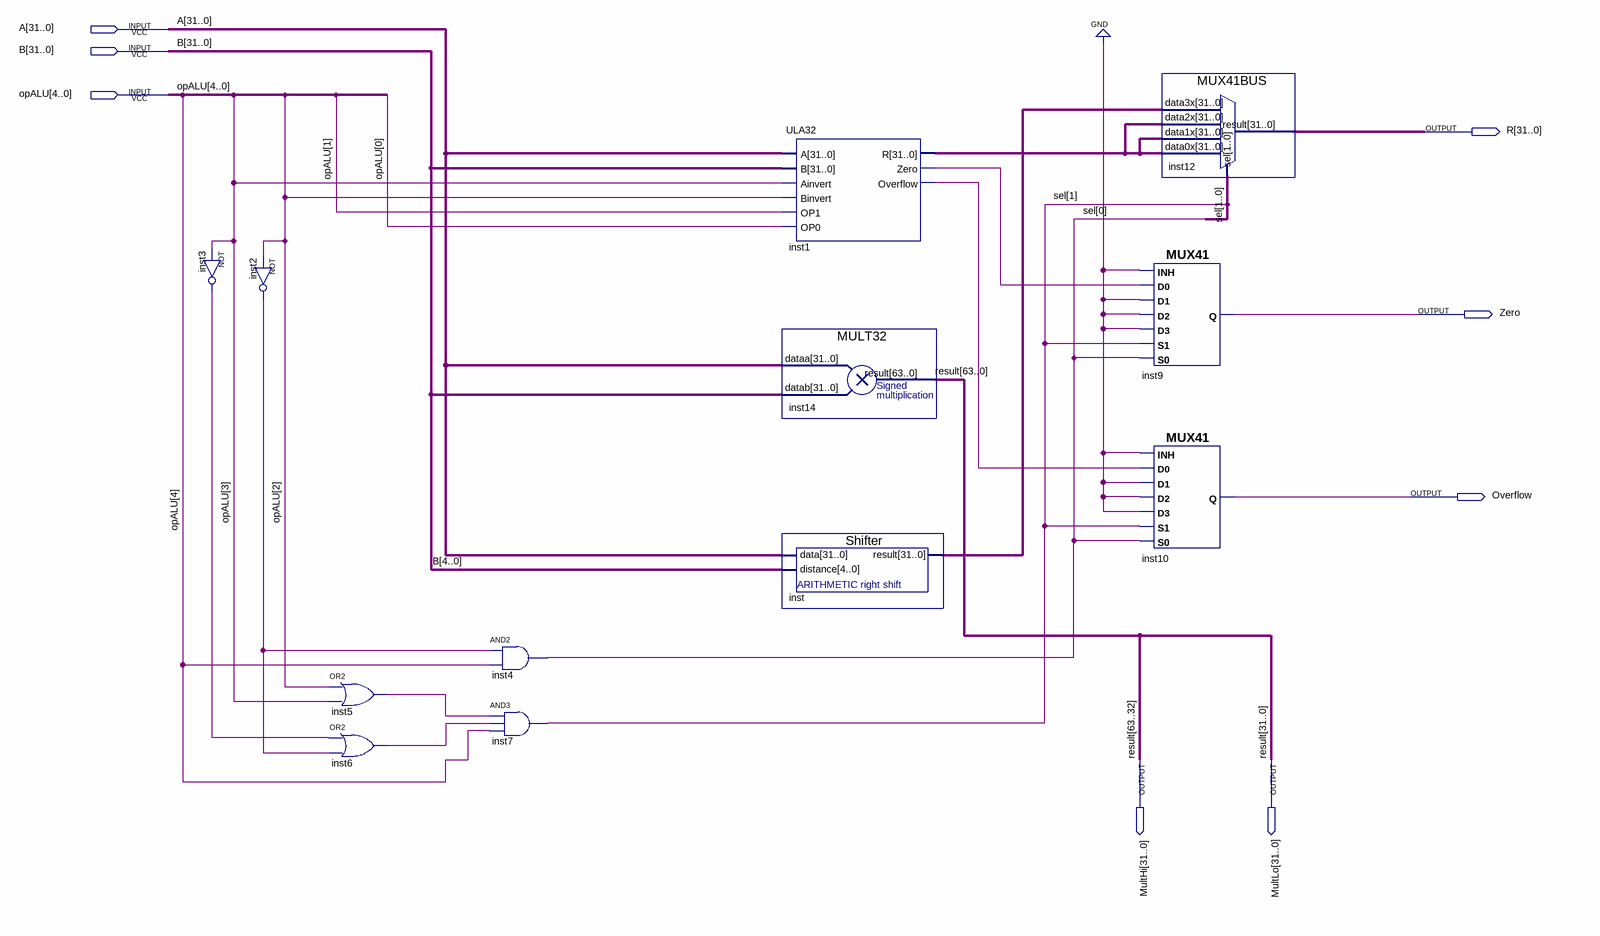
[diagram p0: schematic sheet]
// Quartus schematic MainULA.bdf as structural Verilog: 12 symbols, 8 pins
module MainULA (
  input  [31:0] A,
  input  [31:0] B,
  input  [4:0] opALU,
  output [31:0] R,
  output Zero,
  output Overflow,
  output [31:0] MultHi,
  output [31:0] MultLo
);

  wire inst1_overflow, inst1_zero, inst2_out, inst3_out, inst5_out, inst6_out;
  wire [1:0] sel;
  wire [31:0] inst1_r, inst_result;

  not inst3 (inst3_out, opALU[3]);
  not inst2 (inst2_out, opALU[2]);
  or inst5 (inst5_out, opALU[2], opALU[3]);
  or inst6 (inst6_out, inst3_out, inst2_out);
  and inst4 (sel[0], inst2_out, opALU[4]);
  and inst7 (sel[1], inst5_out, inst6_out, opALU[4]);
  ULA32 inst1 (
    .A(A), .B(B), .Ainvert(opALU[3]), .Binvert(opALU[2]), .OP1(opALU[1]), .OP0(opALU[0]), .R(inst1_r),
    .Zero(inst1_zero), .Overflow(inst1_overflow));
  MULT32 inst14 (.dataa(A), .datab(B), .result({MultHi, MultLo}));
  Shifter inst (.data(A), .distance(B[4:0]), .result(inst_result));
  MUX41BUS inst12 (.data3x(inst_result), .data2x(inst1_r), .data1x(inst1_r), .data0x(inst1_r), .sel(sel), .result(R));
  MUX41 inst9 (.S0(sel[0]), .D2(1'b0), .S1(sel[1]), .D3(1'b0), .D0(inst1_zero), .INH(1'b0), .D1(1'b0), .Q(Zero));
  MUX41 inst10 (
    .S0(sel[0]), .D2(1'b0), .S1(sel[1]), .D3(1'b0), .D0(inst1_overflow), .INH(1'b0), .D1(1'b0), .Q(Overflow));

  // Other names for the same wires on the sheet: result[63:0] = {MultHi, MultLo}
endmodule
